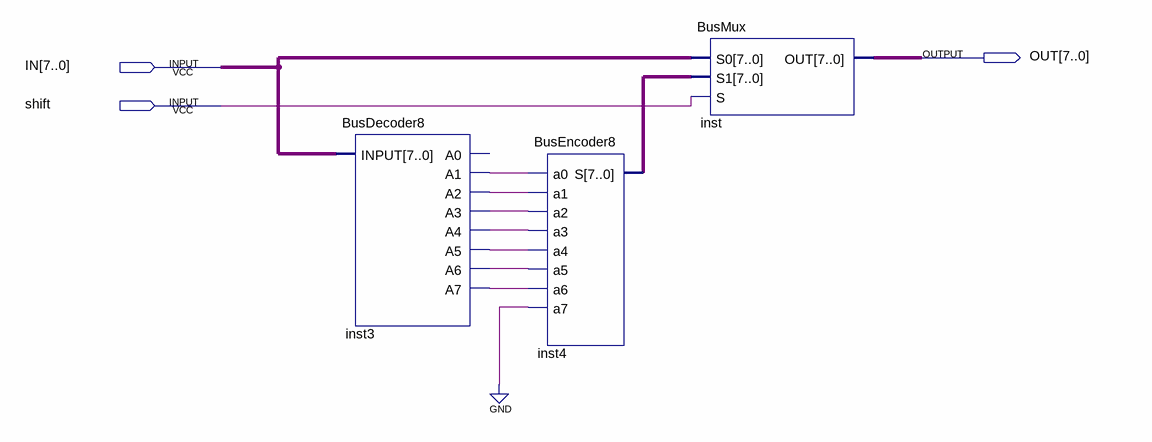
[diagram p0: schematic sheet]
// Quartus schematic Shift1Bit.bdf as structural Verilog: 3 symbols, 3 pins
module Shift1Bit (
  input  [7:0] IN,
  input  shift,
  output [7:0] OUT
);

  wire inst3_a1, inst3_a2, inst3_a3, inst3_a4, inst3_a5, inst3_a6, inst3_a7;
  wire [7:0] inst4_s;

  BusDecoder8 inst3 (
    .INPUT(IN), .A1(inst3_a1), .A2(inst3_a2), .A3(inst3_a3), .A4(inst3_a4), .A5(inst3_a5), .A6(inst3_a6),
    .A7(inst3_a7));  // open: A0
  BusEncoder8 inst4 (
    .a0(inst3_a1), .a1(inst3_a2), .a2(inst3_a3), .a3(inst3_a4), .a4(inst3_a5), .a5(inst3_a6), .a6(inst3_a7),
    .a7(1'b0), .S(inst4_s));
  BusMux inst (.S0(IN), .S1(inst4_s), .S(shift), .OUT(OUT));
endmodule
